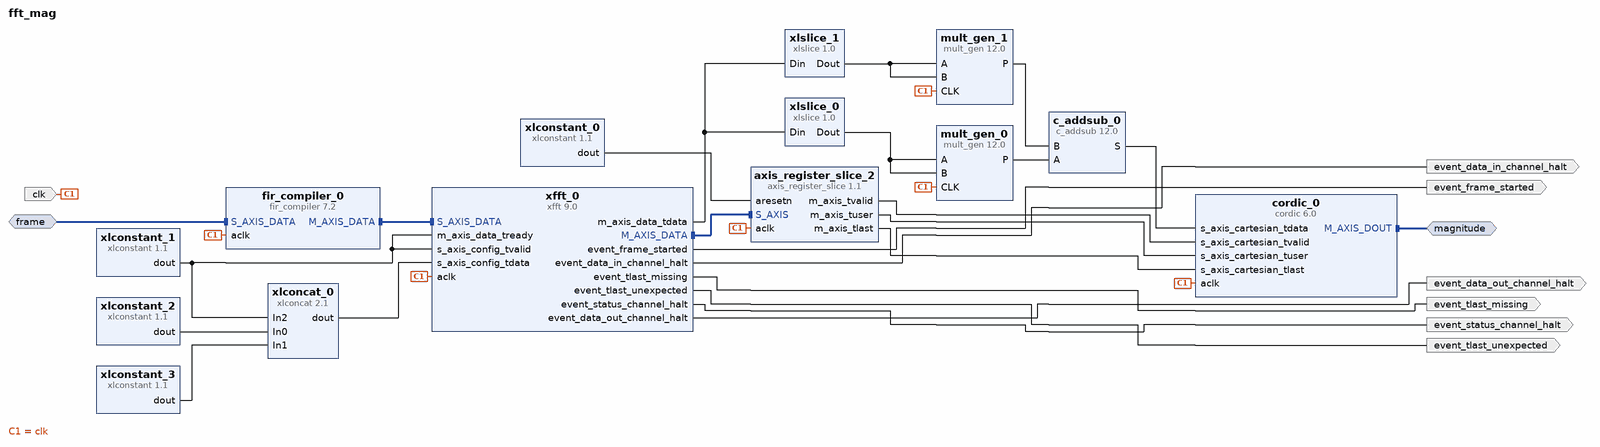
[diagram p0: block diagram of the top level]
# Vivado block design fft_mag, Vivado 2016.2
create_bd_design fft_mag

create_bd_intf_port -mode Slave -vlnv xilinx.com:interface:axis_rtl:1.0 frame
set_property -dict [list \
  CONFIG.TDATA_NUM_BYTES 1 \
  CONFIG.TDEST_WIDTH 0 \
  CONFIG.TID_WIDTH 0 \
  CONFIG.TUSER_WIDTH 0 \
  CONFIG.HAS_TREADY 1 \
  CONFIG.HAS_TSTRB 0 \
  CONFIG.HAS_TKEEP 0 \
  CONFIG.HAS_TLAST 1 \
  CONFIG.FREQ_HZ 100000000 \
  CONFIG.LAYERED_METADATA undef \
] [get_bd_intf_ports frame]
create_bd_intf_port -mode Master -vlnv xilinx.com:interface:axis_rtl:1.0 magnitude
set_property -dict {CONFIG.FREQ_HZ 100000000} [get_bd_intf_ports magnitude]
create_bd_port -dir I -type clk clk
set_property -dict {CONFIG.FREQ_HZ 100000000 CONFIG.ASSOCIATED_BUSIF frame:magnitude} [get_bd_ports clk]
create_bd_port -dir O -type intr event_tlast_missing
create_bd_port -dir O -type intr event_frame_started
create_bd_port -dir O -type intr event_tlast_unexpected
create_bd_port -dir O -type intr event_status_channel_halt
create_bd_port -dir O -type intr event_data_in_channel_halt
create_bd_port -dir O -type intr event_data_out_channel_halt

create_bd_cell -type ip -vlnv xilinx.com:ip:axis_register_slice:1.1 axis_register_slice_2
set_property -dict {CONFIG.TUSER_WIDTH 12 CONFIG.HAS_TREADY 0 CONFIG.HAS_TLAST 1} [get_bd_cells axis_register_slice_2]
create_bd_cell -type ip -vlnv xilinx.com:ip:c_addsub:12.0 c_addsub_0
set_property -dict {CONFIG.Latency 0} [get_bd_cells c_addsub_0]
create_bd_cell -type ip -vlnv xilinx.com:ip:cordic:6.0 cordic_0
set_property -dict [list \
  CONFIG.Functional_Selection Square_Root \
  CONFIG.Data_Format UnsignedInteger \
  CONFIG.Input_Width 16 \
  CONFIG.Output_Width 9 \
  CONFIG.Round_Mode Nearest_Even \
  CONFIG.Coarse_Rotation false \
  CONFIG.cartesian_has_tuser true \
  CONFIG.cartesian_tuser_width 12 \
  CONFIG.cartesian_has_tlast true \
  CONFIG.out_tlast_behv Pass_Cartesian_TLAST \
] [get_bd_cells cordic_0]
create_bd_cell -type ip -vlnv xilinx.com:ip:mult_gen:12.0 mult_gen_0
set_property -dict [list \
  CONFIG.PortAWidth 8 \
  CONFIG.PortBWidth 8 \
  CONFIG.Multiplier_Construction Use_Mults \
  CONFIG.OptGoal Speed \
] [get_bd_cells mult_gen_0]
create_bd_cell -type ip -vlnv xilinx.com:ip:mult_gen:12.0 mult_gen_1
set_property -dict [list \
  CONFIG.PortAWidth 8 \
  CONFIG.PortBWidth 8 \
  CONFIG.Multiplier_Construction Use_Mults \
  CONFIG.Use_Custom_Output_Width false \
] [get_bd_cells mult_gen_1]
create_bd_cell -type ip -vlnv xilinx.com:ip:xfft:9.0 xfft_0
set_property -dict [list \
  CONFIG.transform_length 1024 \
  CONFIG.target_clock_frequency 100 \
  CONFIG.implementation_options pipelined_streaming_io \
  CONFIG.input_width 20 \
  CONFIG.phase_factor_width 20 \
  CONFIG.scaling_options scaled \
  CONFIG.rounding_modes convergent_rounding \
  CONFIG.xk_index true \
  CONFIG.number_of_stages_using_block_ram_for_data_and_phase_factors 1 \
  CONFIG.memory_options_hybrid true \
  CONFIG.complex_mult_type use_mults_resources \
  CONFIG.butterfly_type use_luts \
] [get_bd_cells xfft_0]
create_bd_cell -type ip -vlnv xilinx.com:ip:xlconstant:1.1 xlconstant_0
set_property -dict {CONFIG.CONST_VAL 0} [get_bd_cells xlconstant_0]
create_bd_cell -type ip -vlnv xilinx.com:ip:xlconstant:1.1 xlconstant_1
set_property -dict {CONFIG.CONST_VAL 1} [get_bd_cells xlconstant_1]
create_bd_cell -type ip -vlnv xilinx.com:ip:xlconstant:1.1 xlconstant_2
set_property -dict {CONFIG.CONST_WIDTH 2 CONFIG.CONST_VAL 1} [get_bd_cells xlconstant_2]
create_bd_cell -type ip -vlnv xilinx.com:ip:xlslice:1.0 xlslice_0
set_property -dict {CONFIG.DOUT_WIDTH 8 CONFIG.DIN_TO 32 CONFIG.DIN_FROM 39 CONFIG.DIN_WIDTH 40} [get_bd_cells xlslice_0]
create_bd_cell -type ip -vlnv xilinx.com:ip:xlslice:1.0 xlslice_1
set_property -dict {CONFIG.DOUT_WIDTH 8 CONFIG.DIN_TO 12 CONFIG.DIN_FROM 19 CONFIG.DIN_WIDTH 40} [get_bd_cells xlslice_1]
create_bd_cell -type ip -vlnv xilinx.com:ip:xlconcat:2.1 xlconcat_0
set_property -dict {CONFIG.NUM_PORTS 3} [get_bd_cells xlconcat_0]
create_bd_cell -type ip -vlnv xilinx.com:ip:xlconstant:1.1 xlconstant_3
set_property -dict {CONFIG.CONST_WIDTH 13 CONFIG.CONST_VAL 2730} [get_bd_cells xlconstant_3]
create_bd_cell -type ip -vlnv xilinx.com:ip:fir_compiler:7.2 fir_compiler_0
set_property -dict [list \
  CONFIG.CoefficientVector 0,3,0,9,0,14,0,0,0,-52,0,-138,0,-222,0,769,0,-222,0,-138,0,-52,0,0,0,14,0,9,0,3,0 \
  CONFIG.Coefficient_Sets 1 \
  CONFIG.Clock_Frequency 100 \
  CONFIG.Coefficient_Sign Signed \
  CONFIG.Quantization Integer_Coefficients \
  CONFIG.Coefficient_Width 16 \
  CONFIG.Coefficient_Fractional_Bits 0 \
  CONFIG.Coefficient_Structure Inferred \
  CONFIG.Data_Sign Unsigned \
  CONFIG.Data_Width 8 \
  CONFIG.Output_Rounding_Mode Full_Precision \
  CONFIG.Output_Width 20 \
  CONFIG.Filter_Architecture Systolic_Multiply_Accumulate \
  CONFIG.M_DATA_Has_TREADY false \
] [get_bd_cells fir_compiler_0]

# ---- connections ----

connect_bd_intf_net [get_bd_intf_pins axis_register_slice_2/S_AXIS] [get_bd_intf_pins xfft_0/M_AXIS_DATA]
connect_bd_intf_net [get_bd_intf_pins fir_compiler_0/M_AXIS_DATA] [get_bd_intf_pins xfft_0/S_AXIS_DATA]
connect_bd_intf_net [get_bd_intf_ports frame] [get_bd_intf_pins fir_compiler_0/S_AXIS_DATA]
connect_bd_intf_net [get_bd_intf_ports magnitude] [get_bd_intf_pins cordic_0/M_AXIS_DOUT]
connect_bd_net [get_bd_pins xfft_0/m_axis_data_tdata] [get_bd_pins xlslice_0/Din] [get_bd_pins xlslice_1/Din]
connect_bd_net [get_bd_pins xlslice_0/Dout] [get_bd_pins mult_gen_0/A] [get_bd_pins mult_gen_0/B]
connect_bd_net [get_bd_pins xlslice_1/Dout] [get_bd_pins mult_gen_1/A] [get_bd_pins mult_gen_1/B]
connect_bd_net [get_bd_pins mult_gen_1/P] [get_bd_pins c_addsub_0/B]
connect_bd_net [get_bd_pins mult_gen_0/P] [get_bd_pins c_addsub_0/A]
connect_bd_net [get_bd_pins c_addsub_0/S] [get_bd_pins cordic_0/s_axis_cartesian_tdata]
connect_bd_net [get_bd_ports clk] \
  [get_bd_pins axis_register_slice_2/aclk] [get_bd_pins cordic_0/aclk] [get_bd_pins mult_gen_0/CLK] \
  [get_bd_pins mult_gen_1/CLK] [get_bd_pins xfft_0/aclk] [get_bd_pins fir_compiler_0/aclk]
connect_bd_net [get_bd_pins xlconstant_0/dout] [get_bd_pins axis_register_slice_2/aresetn]
connect_bd_net [get_bd_pins xfft_0/event_tlast_missing] [get_bd_ports event_tlast_missing]
connect_bd_net [get_bd_pins xlconstant_1/dout] \
  [get_bd_pins xfft_0/m_axis_data_tready] [get_bd_pins xlconcat_0/In2] [get_bd_pins xfft_0/s_axis_config_tvalid]
connect_bd_net [get_bd_pins axis_register_slice_2/m_axis_tvalid] [get_bd_pins cordic_0/s_axis_cartesian_tvalid]
connect_bd_net [get_bd_pins axis_register_slice_2/m_axis_tuser] [get_bd_pins cordic_0/s_axis_cartesian_tuser]
connect_bd_net [get_bd_pins axis_register_slice_2/m_axis_tlast] [get_bd_pins cordic_0/s_axis_cartesian_tlast]
connect_bd_net [get_bd_pins xlconcat_0/dout] [get_bd_pins xfft_0/s_axis_config_tdata]
connect_bd_net [get_bd_pins xlconstant_2/dout] [get_bd_pins xlconcat_0/In0]
connect_bd_net [get_bd_pins xlconstant_3/dout] [get_bd_pins xlconcat_0/In1]
connect_bd_net [get_bd_pins xfft_0/event_frame_started] [get_bd_ports event_frame_started]
connect_bd_net [get_bd_pins xfft_0/event_tlast_unexpected] [get_bd_ports event_tlast_unexpected]
connect_bd_net [get_bd_pins xfft_0/event_status_channel_halt] [get_bd_ports event_status_channel_halt]
connect_bd_net [get_bd_pins xfft_0/event_data_in_channel_halt] [get_bd_ports event_data_in_channel_halt]
connect_bd_net [get_bd_pins xfft_0/event_data_out_channel_halt] [get_bd_ports event_data_out_channel_halt]

validate_bd_design
save_bd_design
